# Altium schematic sheet Schema led.SchDoc
size A4
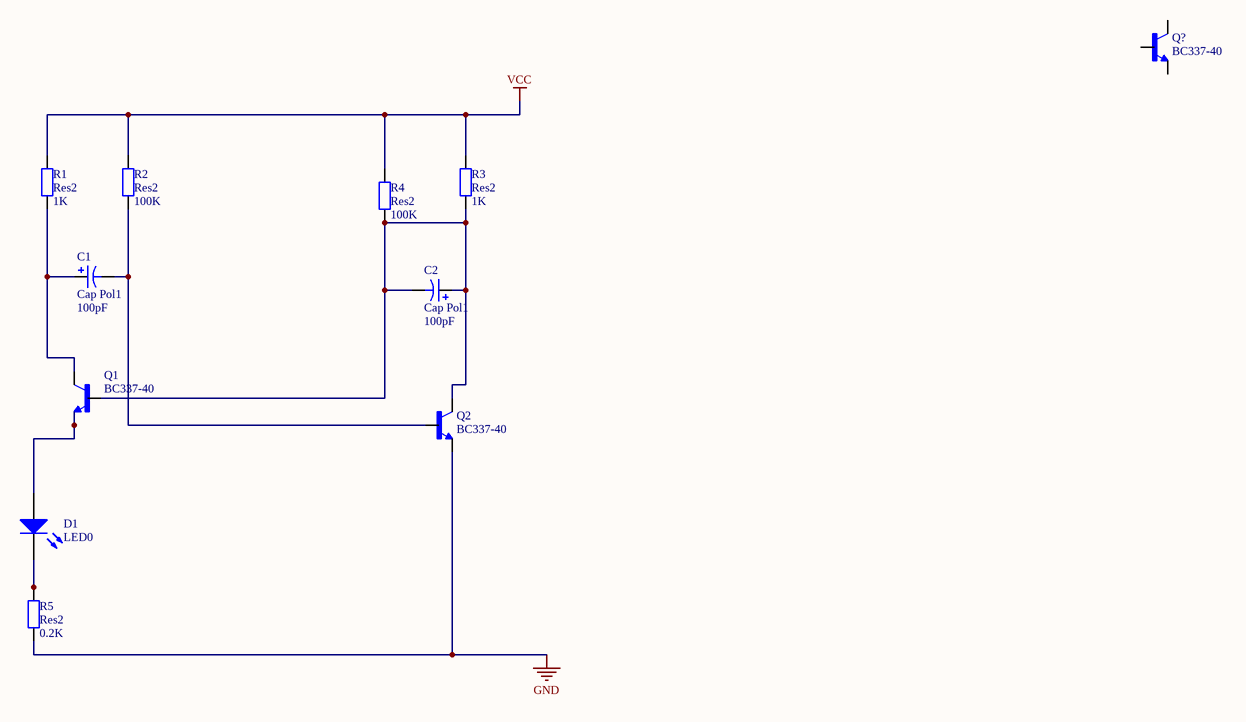
[diagram p0: Schema led.SchDoc]

## Parts
C1  Cap Pol1  value 100pF  [Capacitor 1206]
C2  Cap Pol1  value 100pF  [Capacitor 1206]
D1  LED0  [LED-1]
Q1  BC337-40  [TO92250P510H770-3]
Q2  BC337-40  [TO92250P510H770-3]
Q?  BC337-40  [TO92250P510H770-3]
R1  Res2  value 1K  [Resistor 1206]
R2  Res2  value 100K  [Resistor 1206]
R3  Res2  value 1K  [Resistor 1206]
R4  Res2  value 100K  [Resistor 1206]
R5  Res2  value 0.2K  [Resistor 1206]

## Nets
GND: Q2.3(E) R5.1
VCC: R1.2 R2.2 R3.2 R4.2
NetC1_1: C1.1 Q1.1(C) R1.1
NetC1_2: C1.2 Q2.2(B) R2.1
NetC2_1: C2.1 C2.2 Q1.2(B) Q2.1(C) R3.1 R4.1
NetD1_1: D1.1(A) Q1.3(E)
NetD1_2: D1.2(K) R5.2

Not connected (* = marked no-connect by the designer): Q? 1(C) 2(B) 3(E)

## Library data of the parts
C1 C2 = Cap Pol1: Polarized Capacitor (Radial); Published: 8-Jun-2000; LatestRevisionDate: 17-Jul-2002; LatestRevisionNote: Re-released for DXP Platform.; PackageReference: RB7.6-15; Publisher: Altium Limited; PackageDescription: Polarized Capacitor (Radial); 2 Leads
D1 = LED0: Typical INFRARED GaAs LED; Published: 8-Jun-2000; LatestRevisionDate: 08-Jul-2005; LatestRevisionNote: Mech Layer 1 removed.; PackageReference: LED-0; Publisher: Altium Limited; PackageDescription: LED; 2 Leads
Q1 Q2 Q? = BC337-40: Semiconductors and Actives, NPN BJT, Transistors, Discretes (diodes, transistors, thyristors ...), BJTs; MF: ON Semiconductor; Value: *; Purchase-URL: https://pricing.snapeda.com/search/part/BC337-40/?ref=eda; Package: E-PKG AXIAL-LEADED-2 ON Semiconductor; MP: BC337-40; Check_prices: https://www.snapeda.com/parts/BC337-40/Onsemi/view-part/?ref=eda; SnapEDA_Link: https://www.snapeda.com/parts/BC337-40/Onsemi/view-part/?ref=snap; Price: None; Availability: In Stock
R1-R5 = Res2: Resistor; Published: 8-Jun-2000; LatestRevisionDate: 17-Jul-2002; LatestRevisionNote: Re-released for DXP Platform.; PackageReference: AXIAL-0.4; Publisher: Altium Limited; PackageDescription: Axial Device, Thru-Hole; 2 Leads; 0.4 in Pin Spacing